# EAGLE schematic Daughter Card v7 fixed (EAGLE 8.4.1)
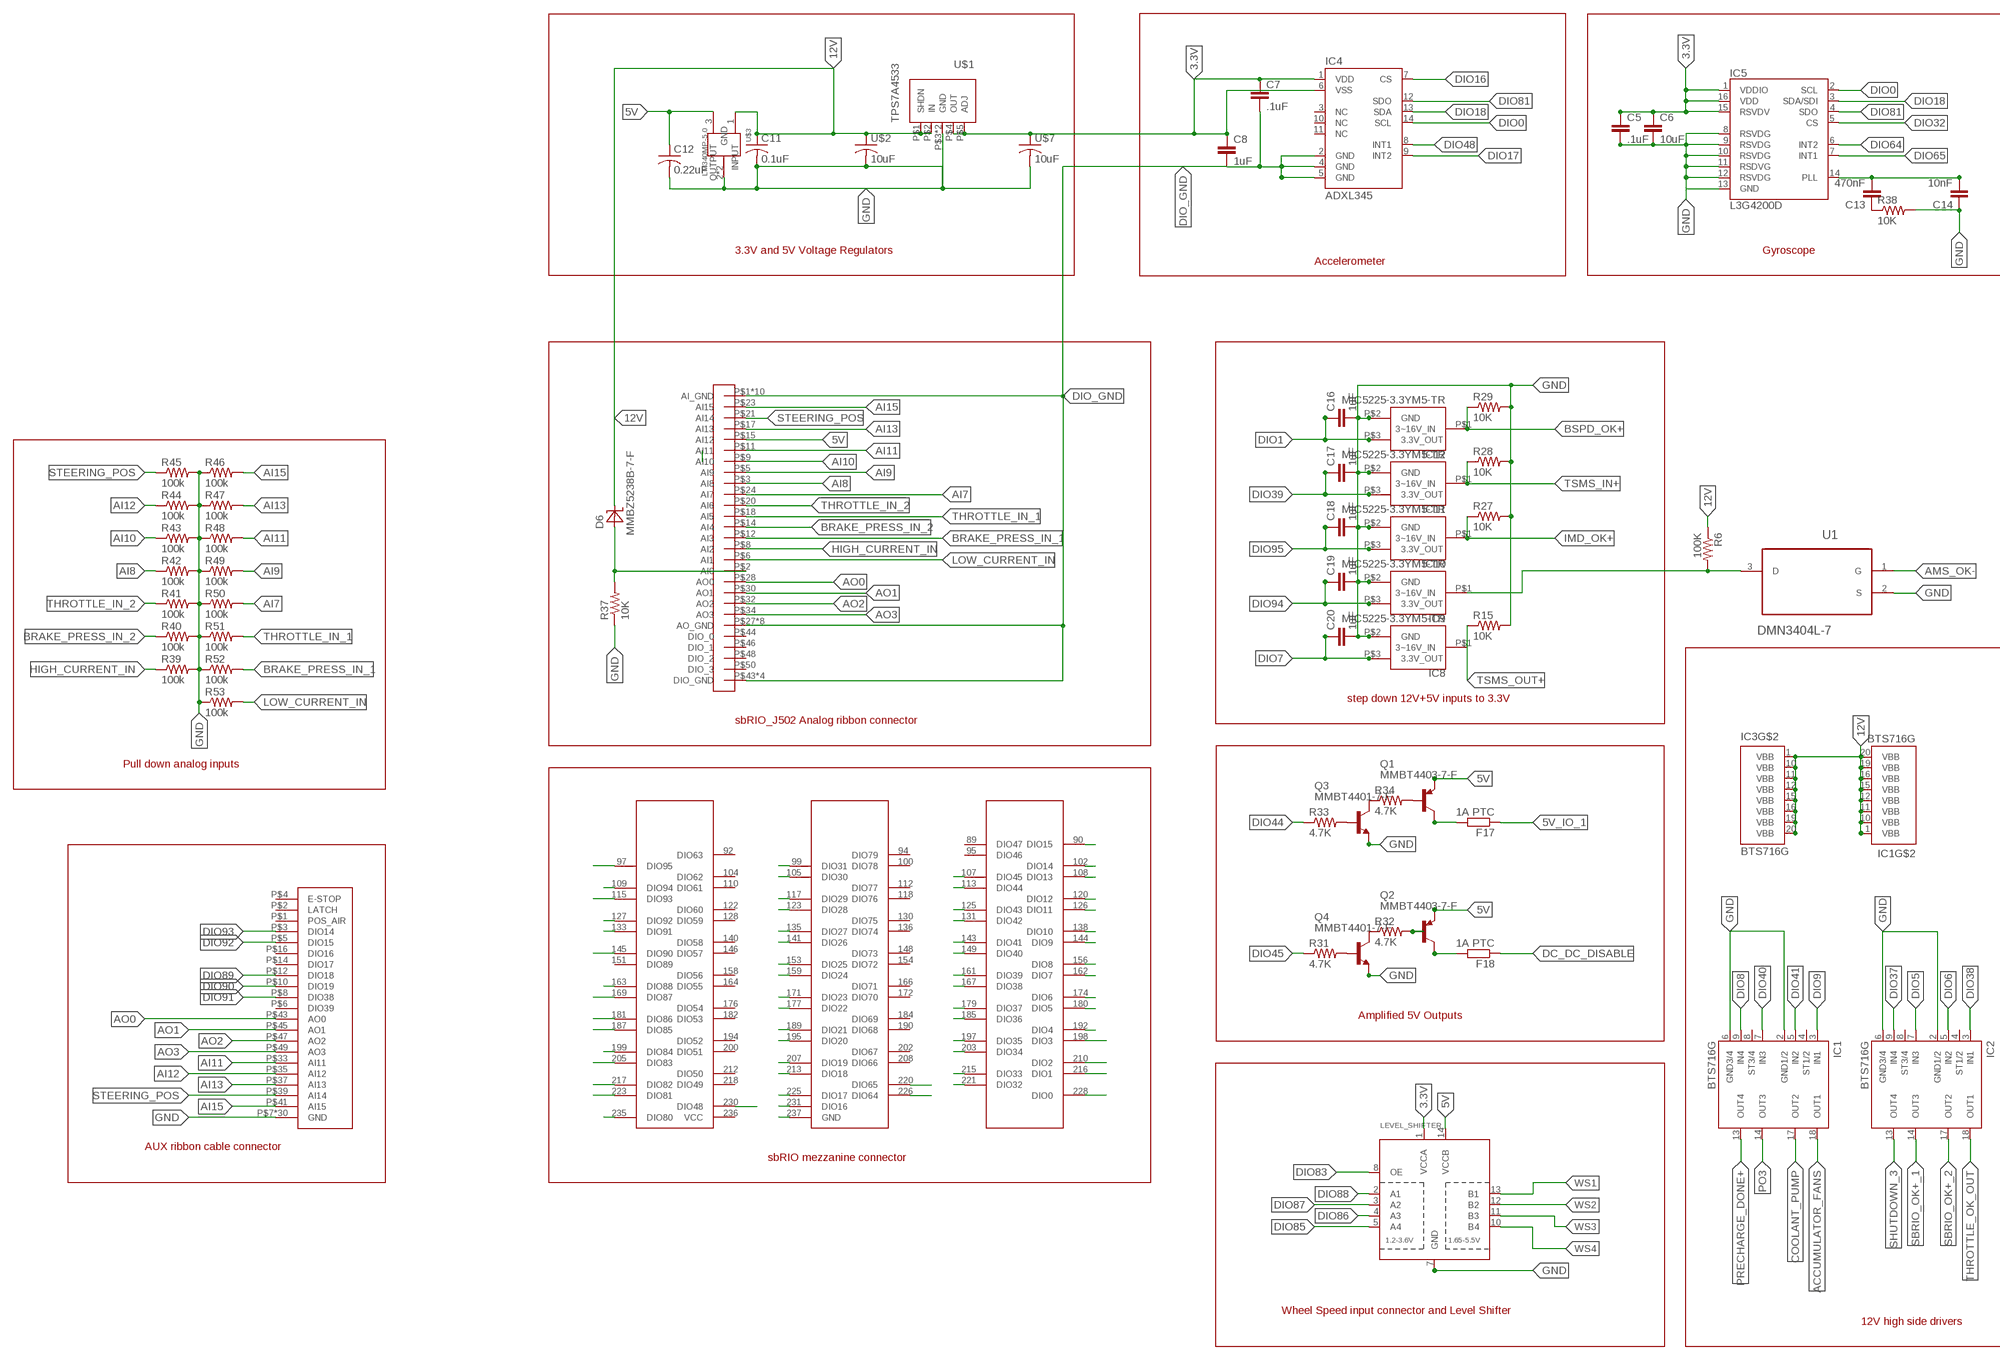
[diagram p0: schematic, sheet 1, part 1 of 2]
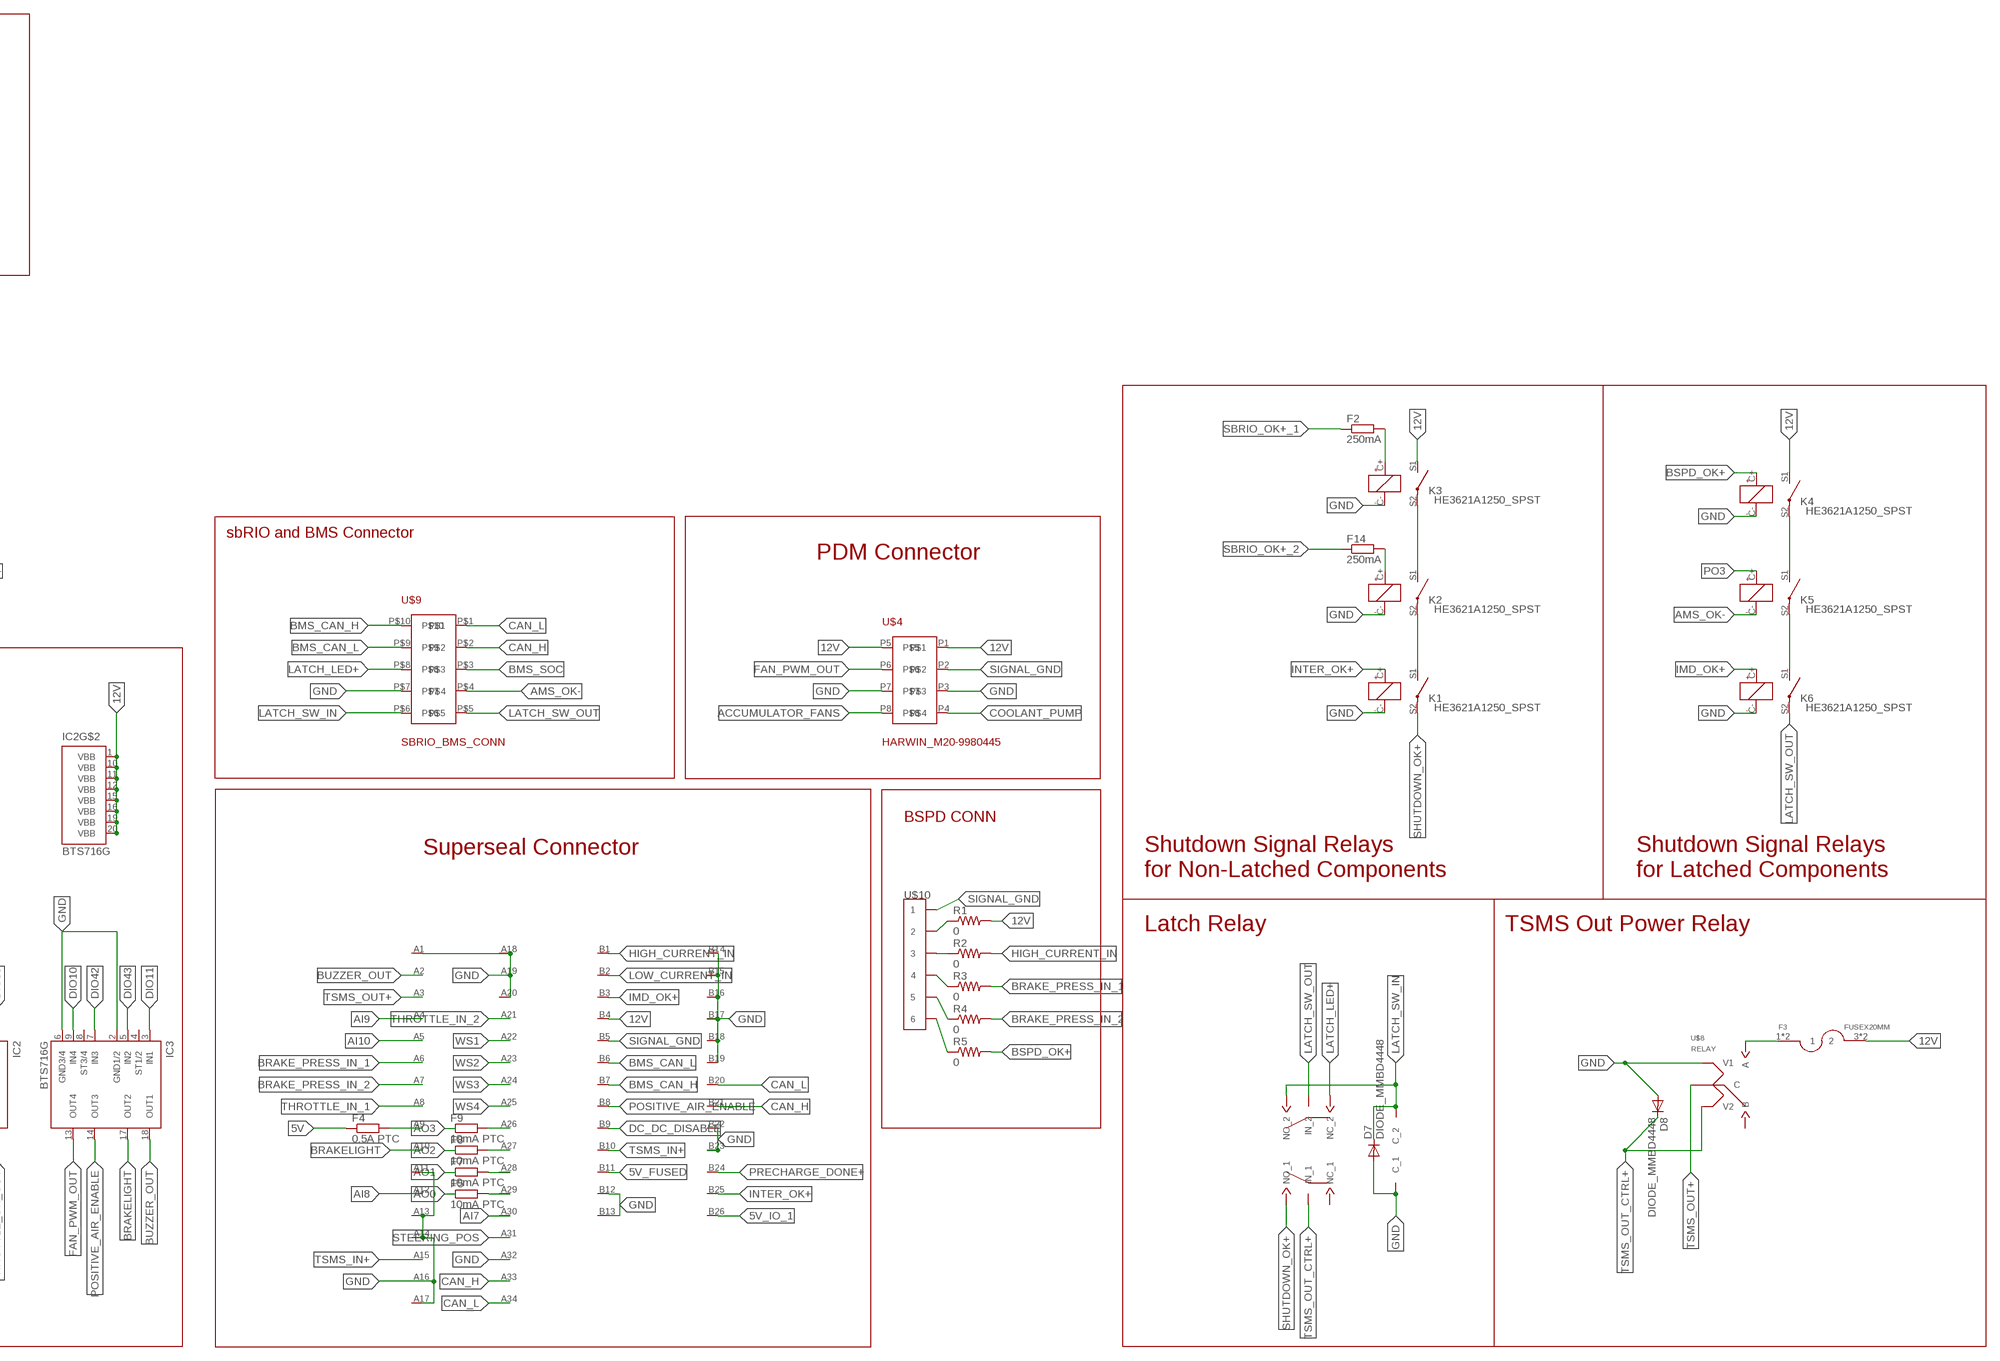
[diagram p1: schematic, sheet 1, part 2 of 2]

## Parts
C5  .1uF  CAP0603-CAP  [0603-CAP]
C6  10uF  CAP0603-CAP  [0603-CAP]
C7  .1uF  CAP0603-CAP  [0603-CAP]
C8  1uF  CAP0603-CAP  [0603-CAP]
C11  0.1uF  C-USC1206  [C1206]
C12  0.22uF  C-USC1206  [C1206]
C13  470nF  CAP0603-CAP  [0603-CAP]
C14  10nF  CAP0603-CAP  [0603-CAP]
C16  1uF  CAP0603-CAP  [0603-CAP]
C17  1uF  CAP0603-CAP  [0603-CAP]
C18  1uF  CAP0603-CAP  [0603-CAP]
C19  1uF  CAP0603-CAP  [0603-CAP]
C20  1uF  CAP0603-CAP  [0603-CAP]
D6  MMBZ5238B-7-F  [SOT-23-3]
D7  DIODE_MMBD4448  [SOT-23-3]
D8  DIODE_MMBD4448  [SOT-23-3]
F2  250mA  R-EU_R0603  [R0603]
F3  FUSEX20MM  [FUSE_5MM]
F4  0.5A PTC  R-EU_R0603  [R0603]
F5  10mA PTC  R-EU_R0603  [R0603]
F7  10mA PTC  R-EU_R0603  [R0603]
F8  10mA PTC  R-EU_R0603  [R0603]
F9  10mA PTC  R-EU_R0603  [R0603]
F14  250mA  R-EU_R0603  [R0603]
F17  1A PTC  R-EU_R0603  [R0603]
F18  1A PTC  R-EU_R0603  [R0603]
IC1  BTS716G  [PG-DSO-20]
IC2  BTS716G  [PG-DSO-20]
IC3  BTS716G  [PG-DSO-20]
IC4  ADXL345  [LGA14]
IC5  L3G4200D  [LGA16-4X4]
IC8  MIC5225-3.3YM5-TR  [SOT-23-3]
IC9  MIC5225-3.3YM5-TR  [SOT-23-3]
IC10  MIC5225-3.3YM5-TR  [SOT-23-3]
IC11  MIC5225-3.3YM5-TR  [SOT-23-3]
IC12  MIC5225-3.3YM5-TR  [SOT-23-3]
K1  HE3621A1250_SPST  [HE3621A1250_SPST]
K2  HE3621A1250_SPST  [HE3621A1250_SPST]
K3  HE3621A1250_SPST  [HE3621A1250_SPST]
K4  HE3621A1250_SPST  [HE3621A1250_SPST]
K5  HE3621A1250_SPST  [HE3621A1250_SPST]
K6  HE3621A1250_SPST  [HE3621A1250_SPST]
LATCH_U7  JW2SN-DC12V  [DPDT_JW2_FORM_C]
LEVEL_SHIFTER  TXB0104PWR  [TSSOP14]
Q1  MMBT4403-7-F  [SOT-23-3]
Q2  MMBT4403-7-F  [SOT-23-3]
Q3  MMBT4401-7-F  [SOT-23-3]
Q4  MMBT4401-7-F  [SOT-23-3]
R1  0  R-US_M0805  [M0805]
R2  0  R-US_M0805  [M0805]
R3  0  R-US_M0805  [M0805]
R4  0  R-US_M0805  [M0805]
R5  0  R-US_M0805  [M0805]
R6  100K  R-US_R0603  [R0603]
R15  10K  R-US_R0603  [R0603]
R27  10K  R-US_R0603  [R0603]
R28  10K  R-US_R0603  [R0603]
R29  10K  R-US_R0603  [R0603]
R31  4.7K  R-US_R0603  [R0603]
R32  4.7K  R-US_R0603  [R0603]
R33  4.7K  R-US_R0603  [R0603]
R34  4.7K  R-US_R0603  [R0603]
R37  10K  R-US_R0603  [R0603]
R38  10K  R-US_R0603  [R0603]
R39  100k  R-US_R0603  [R0603]
R40  100k  R-US_R0603  [R0603]
R41  100k  R-US_R0603  [R0603]
R42  100k  R-US_R0603  [R0603]
R43  100k  R-US_R0603  [R0603]
R44  100k  R-US_R0603  [R0603]
R45  100k  R-US_R0603  [R0603]
R46  100k  R-US_R0603  [R0603]
R47  100k  R-US_R0603  [R0603]
R48  100k  R-US_R0603  [R0603]
R49  100k  R-US_R0603  [R0603]
R50  100k  R-US_R0603  [R0603]
R51  100k  R-US_R0603  [R0603]
R52  100k  R-US_R0603  [R0603]
R53  100k  R-US_R0603  [R0603]
SBRIO_ANALOG  SBRIO_MIO  [SBRIO_J502_J503]
SBRIO_AUX  SBRIO_AUX  [SBRIO_J502_J503]
SBRIO_MEZZANINE  SBRIO_RMC  [SEAM-40-XX.X-XX-06-X-A]
U1  DMN3404L-7  [SOT95P235X112-3N]
U$1  TPS7A4533  [TPS7A4533]
U$2  10uF  C-USC1206  [C1206]
U$3  LM340MP-5.0  [SOT-223-4]
U$4  HARWIN_M20-9980445  [HARWIN_M20-9980445]
U$6  SUPERSEAL1.0_60POS  [SUPERSEAL1.0_60POS]
U$7  10uF  C-USC1206  [C1206]
U$8  RELAY  [RELAY]
U$9  SBRIO_BMS_CONN  [SBRIO_W]
U$10  SULLINS_1MM_6P_HEADER  [SULLINS_1MM_HEADER]

## Nets
3.3V: C5.1 C6.1 C7.1 C8.1 IC4.1(VDD) IC4.6(VSS) IC5.1(VDDIO) IC5.15(RSVDV) IC5.16(VDD) LEVEL_SHIFTER.1(VCCA) U$1.P$4(OUT) U$1.P$5(ADJ) U$7.1
5V: C12.1 F4.1 LEVEL_SHIFTER.14(VCCB) Q1.P$3(E) Q2.P$3(E) SBRIO_ANALOG.P$15(AI12) U$3.3(OUTPUT)
5V_FUSED: F4.2 U$6.A9 U$6.B11
5V_IO_1: F17.1 U$6.B26
12V: C11.1 D6.P$1(C) F3.3 F3.4 IC1.1(VBB) IC1.10(VBB) IC1.11(VBB) IC1.12(VBB) IC1.15(VBB) IC1.16(VBB) IC1.19(VBB) IC1.20(VBB) IC2.1(VBB) IC2.10(VBB) IC2.11(VBB) IC2.12(VBB) IC2.15(VBB) IC2.16(VBB) IC2.19(VBB) IC2.20(VBB) IC3.1(VBB) IC3.10(VBB) IC3.11(VBB) IC3.12(VBB) IC3.15(VBB) IC3.16(VBB) IC3.19(VBB) IC3.20(VBB) K3.S1(SW_1) K4.S1(SW_1) R1.2 R6.1 U$1.P$1(SHDN) U$1.P$2(IN) U$2.1 U$3.1(INPUT) U$4.P1 U$4.P5 U$6.B4
ACCUMULATOR_FANS: IC1.18(OUT1) U$4.P8
AI7: R50.2 SBRIO_ANALOG.P$24(AI7) U$6.A30
AI8: R42.1 SBRIO_ANALOG.P$3(AI8) U$6.A12
AI9: R49.2 SBRIO_ANALOG.P$5(AI9) U$6.A4
AI10: R43.1 SBRIO_ANALOG.P$9(AI10) U$6.A5
AI11: R48.2 SBRIO_ANALOG.P$11(AI11) SBRIO_AUX.P$33(AI11)
AI12: R44.1 SBRIO_AUX.P$35(AI12)
AI13: R47.2 SBRIO_ANALOG.P$17(AI13) SBRIO_AUX.P$37(AI13)
AI15: R46.2 SBRIO_ANALOG.P$23(AI15) SBRIO_AUX.P$41(AI15)
AMS_OK-: K5.C- U1.1(G) U$9.P$4
AO0: F5.1 SBRIO_ANALOG.P$28(AO0) SBRIO_AUX.P$43(AO0)
AO1: F7.1 SBRIO_ANALOG.P$30(AO1) SBRIO_AUX.P$45(AO1)
AO2: F8.1 SBRIO_ANALOG.P$32(AO2) SBRIO_AUX.P$47(AO2)
AO3: F9.1 SBRIO_ANALOG.P$34(AO3) SBRIO_AUX.P$49(AO3)
BMS_CAN_H: U$6.B7 U$9.P$10
BMS_CAN_L: U$6.B6 U$9.P$9
BMS_SOC: U$9.P$3
BRAKE_PRESS_IN_1: R3.2 R52.2 SBRIO_ANALOG.P$12(AI3) U$6.A6
BRAKE_PRESS_IN_2: R4.2 R40.1 SBRIO_ANALOG.P$14(AI4) U$6.A7
BRAKELIGHT: IC3.17(OUT2) U$6.A10
BSPD_OK+: IC12.P$1(3~16V_IN) K4.C+ R5.2 R29.1
BUZZER_OUT: IC3.18(OUT1) U$6.A2
CAN_H: U$6.A33 U$6.B21 U$9.P$2
CAN_L: U$6.A34 U$6.B20 U$9.P$1
COOLANT_PUMP: IC1.17(OUT2) U$4.P4
DC_DC_DISABLE: F18.1 U$6.B9
DIO0: IC4.14(SCL) IC5.2(SCL) SBRIO_MEZZANINE.228(DIO0)
DIO1: C16.1 IC12.P$3(3.3V_OUT) SBRIO_MEZZANINE.216(DIO1)
DIO2: SBRIO_MEZZANINE.210(DIO2)
DIO3: SBRIO_MEZZANINE.198(DIO3)
DIO4: SBRIO_MEZZANINE.192(DIO4)
DIO5: IC2.7(IN3) SBRIO_MEZZANINE.180(DIO5)
DIO6: IC2.5(IN2) SBRIO_MEZZANINE.174(DIO6)
DIO7: C20.1 IC8.P$3(3.3V_OUT) SBRIO_MEZZANINE.162(DIO7)
DIO8: IC1.9(IN4) SBRIO_MEZZANINE.156(DIO8)
DIO9: IC1.3(IN1) SBRIO_MEZZANINE.144(DIO9)
DIO10: IC3.9(IN4) SBRIO_MEZZANINE.138(DIO10)
DIO11: IC3.3(IN1) SBRIO_MEZZANINE.126(DIO11)
DIO12: SBRIO_MEZZANINE.120(DIO12)
DIO13: SBRIO_MEZZANINE.108(DIO13)
DIO14: SBRIO_MEZZANINE.102(DIO14)
DIO15: SBRIO_MEZZANINE.90(DIO15)
DIO16: IC4.7(CS) SBRIO_MEZZANINE.231(DIO16)
DIO17: IC4.9(INT2) SBRIO_MEZZANINE.225(DIO17)
DIO18: IC4.13(SDA) IC5.3(SDA/SDI) SBRIO_MEZZANINE.213(DIO18)
DIO19: SBRIO_MEZZANINE.207(DIO19)
DIO20: SBRIO_MEZZANINE.195(DIO20)
DIO21: SBRIO_MEZZANINE.189(DIO21)
DIO22: SBRIO_MEZZANINE.177(DIO22)
DIO23: SBRIO_MEZZANINE.171(DIO23)
DIO24: SBRIO_MEZZANINE.159(DIO24)
DIO25: SBRIO_MEZZANINE.153(DIO25)
DIO26: SBRIO_MEZZANINE.141(DIO26)
DIO27: SBRIO_MEZZANINE.135(DIO27)
DIO28: SBRIO_MEZZANINE.123(DIO28)
DIO29: SBRIO_MEZZANINE.117(DIO29)
DIO30: SBRIO_MEZZANINE.105(DIO30)
DIO31: SBRIO_MEZZANINE.99(DIO31)
DIO32: IC5.5(CS) SBRIO_MEZZANINE.221(DIO32)
DIO33: SBRIO_MEZZANINE.215(DIO33)
DIO34: SBRIO_MEZZANINE.203(DIO34)
DIO35: SBRIO_MEZZANINE.197(DIO35)
DIO36: SBRIO_MEZZANINE.185(DIO36)
DIO37: IC2.9(IN4) SBRIO_MEZZANINE.179(DIO37)
DIO38: IC2.3(IN1) SBRIO_MEZZANINE.167(DIO38)
DIO39: C17.1 IC11.P$3(3.3V_OUT) SBRIO_MEZZANINE.161(DIO39)
DIO40: IC1.7(IN3) SBRIO_MEZZANINE.149(DIO40)
DIO41: IC1.5(IN2) SBRIO_MEZZANINE.143(DIO41)
DIO42: IC3.7(IN3) SBRIO_MEZZANINE.131(DIO42)
DIO43: IC3.5(IN2) SBRIO_MEZZANINE.125(DIO43)
DIO44: R33.1 SBRIO_MEZZANINE.113(DIO44)
DIO45: R31.1 SBRIO_MEZZANINE.107(DIO45)
DIO48: IC4.8(INT1) SBRIO_MEZZANINE.230(DIO48)
DIO64: IC5.6(INT2) SBRIO_MEZZANINE.226(DIO64)
DIO65: IC5.7(INT1) SBRIO_MEZZANINE.220(DIO65)
DIO80: SBRIO_MEZZANINE.235(DIO80)
DIO81: IC4.12(SDO) IC5.4(SDO) SBRIO_MEZZANINE.223(DIO81)
DIO82: SBRIO_MEZZANINE.217(DIO82)
DIO83: LEVEL_SHIFTER.8(OE) SBRIO_MEZZANINE.205(DIO83)
DIO84: SBRIO_MEZZANINE.199(DIO84)
DIO85: LEVEL_SHIFTER.5(A4) SBRIO_MEZZANINE.187(DIO85)
DIO86: LEVEL_SHIFTER.4(A3) SBRIO_MEZZANINE.181(DIO86)
DIO87: LEVEL_SHIFTER.3(A2) SBRIO_MEZZANINE.169(DIO87)
DIO88: LEVEL_SHIFTER.2(A1) SBRIO_MEZZANINE.163(DIO88)
DIO89: SBRIO_AUX.P$12(DIO18)
DIO90: SBRIO_AUX.P$10(DIO19) SBRIO_MEZZANINE.145(DIO90)
DIO91: SBRIO_AUX.P$8(DIO38) SBRIO_MEZZANINE.133(DIO91)
DIO92: SBRIO_AUX.P$5(DIO15) SBRIO_MEZZANINE.127(DIO92)
DIO93: SBRIO_AUX.P$3(DIO14) SBRIO_MEZZANINE.115(DIO93)
DIO94: C19.1 IC9.P$3(3.3V_OUT) SBRIO_MEZZANINE.109(DIO94)
DIO95: C18.1 IC10.P$3(3.3V_OUT) SBRIO_MEZZANINE.97(DIO95)
DIO_GND: C7.2 C8.2 IC4.2(GND) IC4.4(GND) IC4.5(GND) SBRIO_ANALOG.P$1(AI_GND) SBRIO_ANALOG.P$4(AI_GND) SBRIO_ANALOG.P$7(AI_GND) SBRIO_ANALOG.P$10(AI_GND) SBRIO_ANALOG.P$13(AI_GND) SBRIO_ANALOG.P$16(AI_GND) SBRIO_ANALOG.P$19(AI_GND) SBRIO_ANALOG.P$22(AI_GND) SBRIO_ANALOG.P$25(AI_GND) SBRIO_ANALOG.P$26(AI_GND) SBRIO_ANALOG.P$27(AO_GND) SBRIO_ANALOG.P$29(AO_GND) SBRIO_ANALOG.P$31(AO_GND) SBRIO_ANALOG.P$33(AO_GND) SBRIO_ANALOG.P$35(AO_GND) SBRIO_ANALOG.P$37(AO_GND) SBRIO_ANALOG.P$39(AO_GND) SBRIO_ANALOG.P$41(AO_GND) SBRIO_ANALOG.P$43(DIO_GND) SBRIO_ANALOG.P$45(DIO_GND) SBRIO_ANALOG.P$47(DIO_GND) SBRIO_ANALOG.P$49(DIO_GND)
FAN_PWM_OUT: IC3.13(OUT4) U$4.P6
GND: C5.2 C6.2 C11.2 C12.2 C14.1 C16.2 C17.2 C18.2 C19.2 C20.2 D7.P$2(A) D8.P$2(A) IC1.2(GND1/2) IC1.6(GND3/4) IC2.2(GND1/2) IC2.6(GND3/4) IC3.2(GND1/2) IC3.6(GND3/4) IC5.8(RSVDG) IC5.9(RSVDG) IC5.10(RSVDG) IC5.11(RSDVG) IC5.12(RSVDG) IC5.13(GND) IC8.P$2(GND) IC9.P$2(GND) IC10.P$2(GND) IC11.P$2(GND) IC12.P$2(GND) K1.C- K2.C- K3.C- K4.C- K6.C- LATCH_U7.COIL_1(C_1) LEVEL_SHIFTER.7(GND) Q3.P$3(E) Q4.P$3(E) R15.2 R27.2 R28.2 R29.2 R37.1 R38.2 R39.2 R40.2 R41.2 R42.2 R43.2 R44.2 R45.2 R46.1 R47.1 R48.1 R49.1 R50.1 R51.1 R52.1 R53.1 SBRIO_AUX.P$7(GND) SBRIO_AUX.P$9(GND) SBRIO_AUX.P$11(GND) SBRIO_AUX.P$13(GND) SBRIO_AUX.P$15(GND) SBRIO_AUX.P$17(GND) SBRIO_AUX.P$18(GND) SBRIO_AUX.P$19(GND) SBRIO_AUX.P$20(GND) SBRIO_AUX.P$21(GND) SBRIO_AUX.P$22(GND) SBRIO_AUX.P$23(GND) SBRIO_AUX.P$24(GND) SBRIO_AUX.P$25(GND) SBRIO_AUX.P$26(GND) SBRIO_AUX.P$27(GND) SBRIO_AUX.P$28(GND) SBRIO_AUX.P$29(GND) SBRIO_AUX.P$30(GND) SBRIO_AUX.P$31(GND) SBRIO_AUX.P$32(GND) SBRIO_AUX.P$34(GND) SBRIO_AUX.P$36(GND) SBRIO_AUX.P$38(GND) SBRIO_AUX.P$40(GND) SBRIO_AUX.P$42(GND) SBRIO_AUX.P$44(GND) SBRIO_AUX.P$46(GND) SBRIO_AUX.P$48(GND) SBRIO_AUX.P$50(GND) SBRIO_MEZZANINE.237(GND) U1.2(S) U$1.P$3(GND) U$1.P$6(GND) U$2.2 U$3.2(GND) U$3.4(GND) U$4.P3 U$4.P7 U$6.A1 U$6.A11 U$6.A13 U$6.A14 U$6.A16 U$6.A17 U$6.A18 U$6.A19 U$6.A20 U$6.A32 U$6.B12 U$6.B13 U$6.B14 U$6.B15 U$6.B16 U$6.B17 U$6.B18 U$6.B19 U$6.B22 U$6.B23 U$7.2 U$8.V1 U$9.P$7
HIGH_CURRENT_IN: R2.2 R39.1 SBRIO_ANALOG.P$8(AI2) U$6.B1
IMD_OK+: IC10.P$1(3~16V_IN) K6.C+ R27.1 U$6.B3
INTER_OK+: K1.C+ U$6.B25
K4: K4.S2(SW_2) K5.S1(SW_1)
LATCH_LED+: LATCH_U7.NC_2 U$9.P$8
LATCH_SW_IN: D7.P$1(C) LATCH_U7.COIL_2(C_2) LATCH_U7.NO_2 U$9.P$6
LATCH_SW_OUT: K6.S2(SW_2) LATCH_U7.CENTER_2(IN_2) U$9.P$5
LOW_CURRENT_IN: R53.2 SBRIO_ANALOG.P$6(AI1) U$6.B2
N$2: K2.S1(SW_1) K3.S2(SW_2)
N$3: F5.2 U$6.A29
N$4: D6.P$2(A) R37.2 SBRIO_ANALOG.P$2(AI0)
N$5: Q1.P$2(B) R34.2
N$6: F7.2 U$6.A28
N$7: K1.S1(SW_1) K2.S2(SW_2)
N$8: Q3.P$1(C) R34.1
N$9: F8.2 U$6.A27
N$10: F9.2 U$6.A26
N$11: C13.1 R38.1
N$12: R1.1 U$10.P2
N$13: K5.S2(SW_2) K6.S1(SW_1)
N$14: F3.1 F3.2 U$8.A
N$15: R2.1 U$10.P3
N$16: R3.1 U$10.P4
N$17: R4.1 U$10.P5
N$18: Q4.P$1(C) R32.1
N$19: Q4.P$2(B) R31.2
N$20: R5.1 U$10.P6
N$22: Q3.P$2(B) R33.2
N$24: IC9.P$1(3~16V_IN) R6.2 U1.3(D)
N$37: C13.2 C14.2 IC5.14(PLL)
N$56: F17.2 Q1.P$1(C)
N$57: F18.2 Q2.P$1(C)
N$58: Q2.P$2(B) R32.2
PO3: IC1.14(OUT3) K5.C+
POSITIVE_AIR_ENABLE: IC3.14(OUT3) U$6.B8
PRECHARGE_DONE+: IC1.13(OUT4) U$6.B24
SBRIO_OK+_1: F2.1 IC2.14(OUT3)
SBRIO_OK+_1_RELAY_IN: F2.2 K3.C+
SBRIO_OK+_2: F14.1 IC2.17(OUT2)
SBRIO_OK_2_RELAY: F14.2 K2.C+
SHUTDOWN_3: IC2.13(OUT4)
SHUTDOWN_OK+: K1.S2(SW_2) LATCH_U7.NO_1
SIGNAL_GND: U$4.P2 U$6.B5 U$10.P1
STEERING_POS: R45.1 SBRIO_ANALOG.P$21(AI14) SBRIO_AUX.P$39(AI14) U$6.A31
THROTTLE_IN_1: R51.2 SBRIO_ANALOG.P$18(AI5) U$6.A8
THROTTLE_IN_2: R41.1 SBRIO_ANALOG.P$20(AI6) U$6.A21
THROTTLE_OK_OUT: IC2.18(OUT1)
TSMS_IN+: IC11.P$1(3~16V_IN) R28.1 U$6.A15 U$6.B10
TSMS_OUT+: IC8.P$1(3~16V_IN) R15.1 U$6.A3 U$8.CENTER(C)
TSMS_OUT_CTRL+: D8.P$1(C) LATCH_U7.CENTER_1(IN_1) U$8.V2
WS1: LEVEL_SHIFTER.13(B1) U$6.A22
WS2: LEVEL_SHIFTER.12(B2) U$6.A23
WS3: LEVEL_SHIFTER.11(B3) U$6.A24
WS4: LEVEL_SHIFTER.10(B4) U$6.A25
Unconnected: IC1.4(ST1/2) IC1.8(ST3/4) IC2.4(ST1/2) IC2.8(ST3/4) IC3.4(ST1/2) IC3.8(ST3/4) IC4.3(NC) IC4.10(NC) IC4.11(NC) LATCH_U7.NC_1 SBRIO_ANALOG.P$44(DIO_0) SBRIO_ANALOG.P$46(DIO_1) SBRIO_ANALOG.P$48(DIO_2) SBRIO_ANALOG.P$50(DIO_3) SBRIO_AUX.P$1(POS_AIR) SBRIO_AUX.P$2(LATCH) SBRIO_AUX.P$4(E-STOP) SBRIO_AUX.P$6(DIO39) SBRIO_AUX.P$14(DIO17) SBRIO_AUX.P$16(DIO16) SBRIO_MEZZANINE.89(DIO47) SBRIO_MEZZANINE.92(DIO63) SBRIO_MEZZANINE.94(DIO79) SBRIO_MEZZANINE.95(DIO46) SBRIO_MEZZANINE.100(DIO78) SBRIO_MEZZANINE.104(DIO62) SBRIO_MEZZANINE.110(DIO61) SBRIO_MEZZANINE.112(DIO77) SBRIO_MEZZANINE.118(DIO76) SBRIO_MEZZANINE.122(DIO60) SBRIO_MEZZANINE.128(DIO59) SBRIO_MEZZANINE.130(DIO75) SBRIO_MEZZANINE.136(DIO74) SBRIO_MEZZANINE.140(DIO58) SBRIO_MEZZANINE.146(DIO57) SBRIO_MEZZANINE.148(DIO73) SBRIO_MEZZANINE.151(DIO89) SBRIO_MEZZANINE.154(DIO72) SBRIO_MEZZANINE.158(DIO56) SBRIO_MEZZANINE.164(DIO55) SBRIO_MEZZANINE.166(DIO71) SBRIO_MEZZANINE.172(DIO70) SBRIO_MEZZANINE.176(DIO54) SBRIO_MEZZANINE.182(DIO53) SBRIO_MEZZANINE.184(DIO69) SBRIO_MEZZANINE.190(DIO68) SBRIO_MEZZANINE.194(DIO52) SBRIO_MEZZANINE.200(DIO51) SBRIO_MEZZANINE.202(DIO67) SBRIO_MEZZANINE.208(DIO66) SBRIO_MEZZANINE.212(DIO50) SBRIO_MEZZANINE.218(DIO49) U$8.B

## Notes on the sheet
- 3.3V and 5V Voltage Regulators | Gyroscope
- Accelerometer
- sbRIO and BMS Connector
- PDM Connector
- step down 12V+5V inputs to 3.3V
- sbRIO_J502 Analog ribbon connector
- Pull down analog inputs
- BSPD CONN
- Superseal Connector
- Shutdown Signal Relays
  for Non-Latched Components
- Shutdown Signal Relays
  for Latched Components
- Latch Relay | TSMS Out Power Relay
- Amplified 5V Outputs
- AUX ribbon cable connector
- sbRIO mezzanine connector
- Wheel Speed input connector and Level Shifter
- 12V high side drivers

## Power pins joined to a net without a drawn wire
VCC: SBRIO_MEZZANINE.236(VCC)

## Library data of the parts
C5-C8 C13 C14 C16-C20 = SparkFun-Passives:CAP: Capacitor Standard 0603 ceramic capacitor, and 0.1" leaded capacitor.
C11 C12 U$2 U$7 = rcl:C-US: CAPACITOR, American symbol
D6 = formula electric:MMBZ5238B-7-F: Digikey: MMBZ5238B-FDICT-ND
D7 D8 = formula electric:DIODE_MMBD4448
F2 F4 F5 F7-F9 F14 F17 F18 = resistor:R-EU_: RESISTOR, European symbol
F3 = SparkFun-Passives:FUSE
IC1-IC3 = infineon:BTS716G: Smart High-Side Power Switch Four Channels: 4 x 140mOhm staus Feedback Source: http://www.infineon.com/dgdl/BTS716G.pdf; OC_FARNELL: unknown; OC_NEWARK: unknown
IC4 = SparkFun-Sensors:ADXL345: 3-axis SPI/I2C 2/4/8/16g accelerometer
IC5 = SparkFun-Sensors:L3G4200D: L3G4200D Three-axis, digital output gyroscope The L3G4200D is a low-power three-axis angular rate sensor, has a full scale of ±250/±500/±2000 dps and is capable of measuring rates with a user-selectable bandwidth. It includes a sensing element and an IC interface capable of providing the measured angular rate to the external world through a digital interface (I2C/SPI). Package: 4x4x1.1 LGA-16 (LGA16-4x4.PAC)
IC8-IC12 = formula electric:MIC5225-3.3YM5-TR: not the device name DIGIKEY PN: MCP1703T-3302E/CBCT-ND; DIGIKEYPN: MCP1703T-3302E/CBCT-ND
K1-K6 = formula electric:HE3621A1250_SPST
LATCH_U7 = formula electric:JW2SN-DC12V: JW2SN-DC12V, DPDT 5A 12V Coil Relay, Digikey: 255-1117-ND
LEVEL_SHIFTER = SparkFun-DigitalIC:TXB0104PWR: 4-Bit Bi-Directional Level Shifter 1.2V-3.6V (VCCA) to 1.65V-5.5V (VCCB) bi-directional level shifter with auto direction sensing. Max data rate - VCCA 1.8V: 20Mbps (50ns), VCCA 3.3V: 100Mbps (10ns) Digikey: 296-21929-1-ND (TSSOP) IC-11329
Q1 Q2 = formula electric:MMBT4403-7-F
Q3 Q4 = formula electric:MMBT4401-7-F
R1-R5 R15 R27-R29 R31-R34 R37-R53 = resistor:R-US_: RESISTOR, American symbol
R6 = adafruit:R-US_: RESISTOR, American symbol
SBRIO_ANALOG = formula electric:SBRIO_MIO
SBRIO_AUX = formula electric:SBRIO_AUX: An output for a lot of the extra pins on the sbRIO.
SBRIO_MEZZANINE = SEAM-40-XX.X-XX-06-X-A:SBRIO_RMC
U1 = diodes-inc-e14:DMN3404L-7: N-CHANNEL ENHANCEMENT MODE MOSFET; MPN: DMN3404L-7; OC_FARNELL: 1858601; OC_NEWARK: 23T5605; PACKAGE: SOT-23-3; SUPPLIER: Diodes Inc
U$1 = Texas Instruments_By_element14_Batch_1:TPS7A4533; DIGIKEY_P-N: 490-12344-1-ND; P-N: GRT21BC81C106ME01L
U$3 = texas:LM340MP-5.0
U$4 = formula electric:HARWIN_M20-9980445
U$6 = TE:SUPERSEAL1.0_60POS
U$8 = formula electric:RELAY: Digikey: PB1321-ND
U$9 = formula electric:SBRIO_BMS_CONN
U$10 = formula electric:SULLINS_1MM_6P_HEADER